# Altium schematic sheet Sheet1.SchDoc
size A2
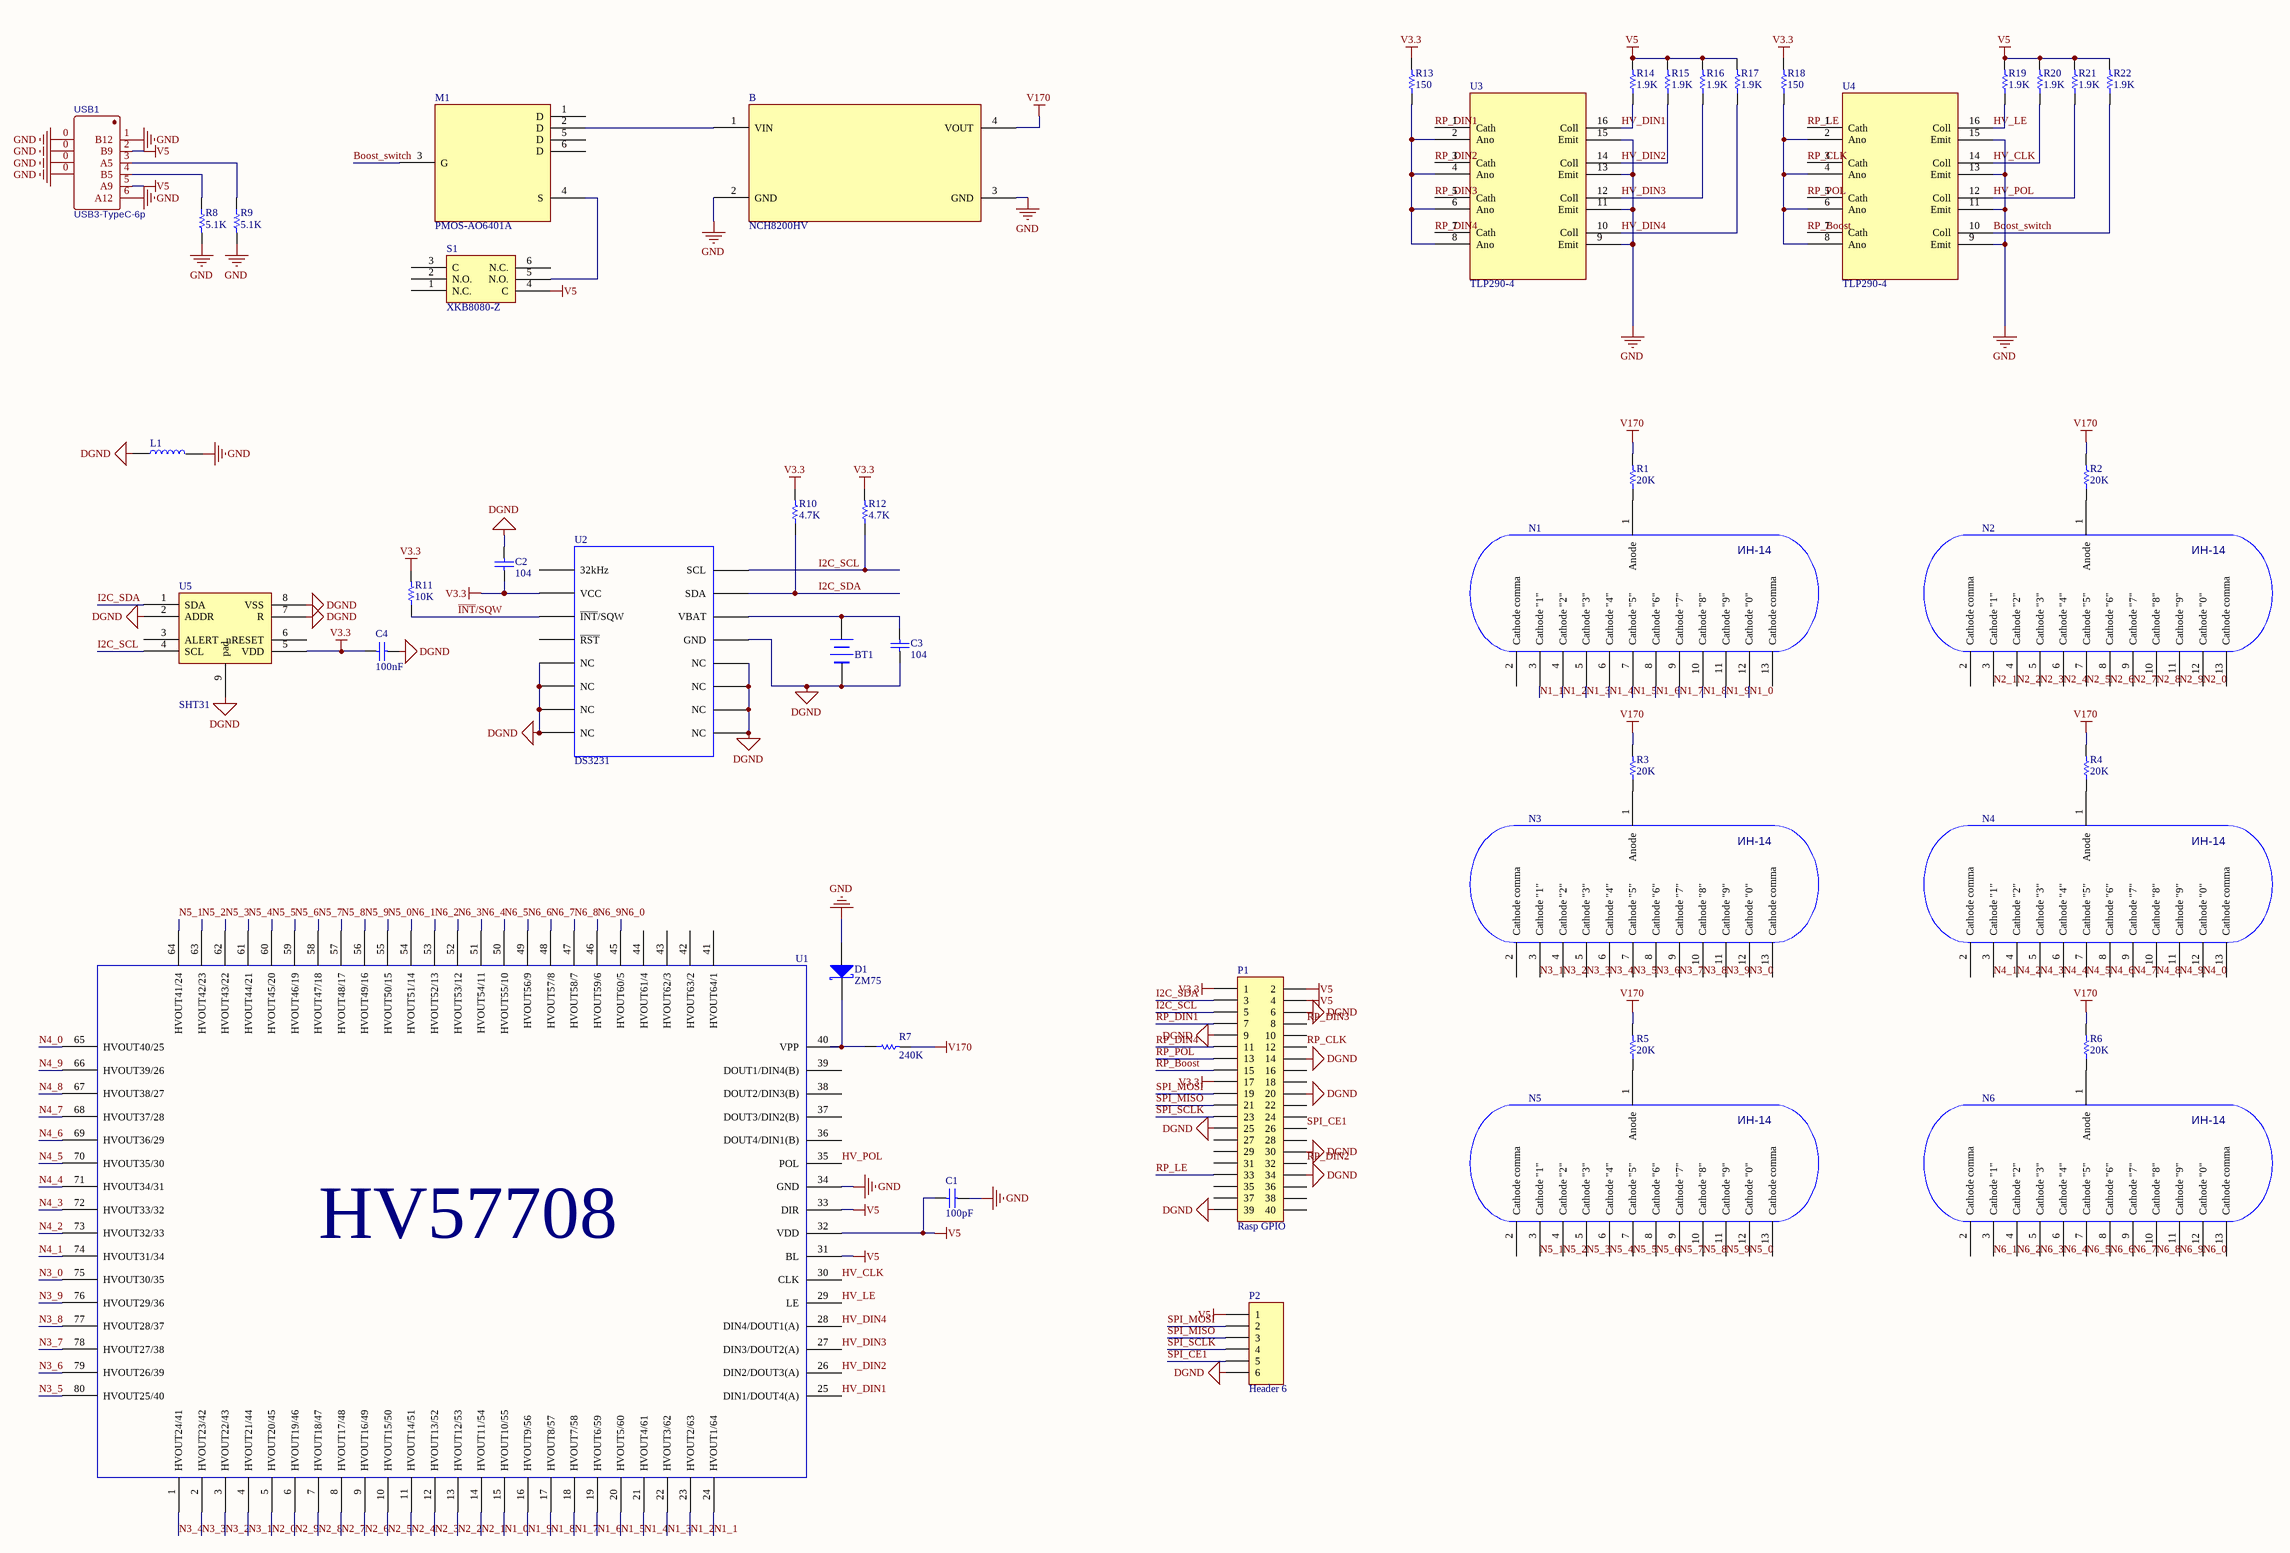
[diagram p0: Sheet1.SchDoc]

## Parts
B  NCH8200HV  [NCH8200HV]
BT1  CR1220 holder  [BAT1220]  (value not drawn)
C1  value 100pF  [C0603]  (hidden comment: Cap)
C2  value 104  [C0603]  (hidden comment: Cap Semi)
C3  value 104  [C0603]  (hidden comment: Cap Semi)
C4  value 100nF  [C0603]  (hidden comment: Cap)
D1  ZM75  [LL-34]
L1  L0  [0805]  (value not drawn)
M1  PMOS-AO6401A  [SOT95P250X110-6N]
N1  ИН-14  [IN14]  (value not drawn)
N2  ИН-14  [IN14]  (value not drawn)
N3  ИН-14  [IN14]  (value not drawn)
N4  ИН-14  [IN14]  (value not drawn)
N5  ИН-14  [IN14]  (value not drawn)
N6  ИН-14  [IN14]  (value not drawn)
P1  Rasp GPIO  [HDR2.54-LI-2x20P]
P2  Header 6  [HDR2.54-LI-6P]
R1  value 20K  [R0603]  (hidden comment: Res Semi)
R2  value 20K  [R0603]  (hidden comment: Res Semi)
R3  value 20K  [R0603]  (hidden comment: Res Semi)
R4  value 20K  [R0603]  (hidden comment: Res Semi)
R5  value 20K  [R0603]  (hidden comment: Res Semi)
R6  value 20K  [R0603]  (hidden comment: Res Semi)
R7  value 240K  [R0603]  (hidden comment: Res Semi)
R8  value 5.1K  [R0603]  (hidden comment: Res Semi)
R9  value 5.1K  [R0603]  (hidden comment: Res Semi)
R10  value 4.7K  [R0603]  (hidden comment: Res Semi)
R11  value 10K  [R0603]  (hidden comment: Res Semi)
R12  value 4.7K  [R0603]  (hidden comment: Res Semi)
R13  value 150  [R0603]  (hidden comment: Res Semi)
R14  value 1.9K  [R0603]  (hidden comment: Res Semi)
R15  value 1.9K  [R0603]  (hidden comment: Res Semi)
R16  value 1.9K  [R0603]  (hidden comment: Res Semi)
R17  value 1.9K  [R0603]  (hidden comment: Res Semi)
R18  value 150  [R0603]  (hidden comment: Res Semi)
R19  value 1.9K  [R0603]  (hidden comment: Res Semi)
R20  value 1.9K  [R0603]  (hidden comment: Res Semi)
R21  value 1.9K  [R0603]  (hidden comment: Res Semi)
R22  value 1.9K  [R0603]  (hidden comment: Res Semi)
S1  XKB8080-Z  [SW_PVA2EEH21.7NV2]
U1  HV57708  [HV57708PG]  (value not drawn)
U2  DS3231  [SOP16_75MM]
U3  TLP290-4  [SO16]
U4  TLP290-4  [SO16]
U5  SHT31  [SHT3x-x-P]
USB1  USB3-TypeC-6p  [USB-TYPE-C-SMD6]

## Nets
DGND: BT1.2(-) C2.2 C3.1 C4.1 L1.1 P1.6 P1.9 P1.14 P1.20 P1.25 P1.30 P1.34 P1.39 P2.6 U2.5(NC) U2.6(NC) U2.7(NC) U2.8(NC) U2.9(NC) U2.10(NC) U2.11(NC) U2.12(NC) U2.13(GND) U5.2(ADDR) U5.7(R) U5.8(VSS) U5.9(pad)
GND: B.2(GND) B.3(GND) C1.1 D1.1(A) L1.2 R8.2 R9.2 U1.34(GND) U3.9(Emit) U3.11(Emit) U3.13(Emit) U3.15(Emit) U4.9(Emit) U4.11(Emit) U4.13(Emit) U4.15(Emit) USB1.0 USB1.1(B12) USB1.6(A12)
V3.3: C2.1 C4.2 P1.1 P1.17 R10.2 R11.2 R12.2 R13.2 R18.2 U2.2(VCC) U5.5(VDD)
V5: C1.2 P1.2 P1.4 P2.1 R14.2 R15.2 R16.2 R17.2 R19.2 R20.2 R21.2 R22.2 S1.4(C) U1.31(BL) U1.32(VDD) U1.33(DIR) USB1.2(B9) USB1.5(A9)
V170: B.4(VOUT) R1.2 R2.2 R3.2 R4.2 R5.2 R6.2 R7.2
~{INT}/SQW: R11.1 U2.3(~{INT}/SQW)
Boost_switch: M1.3(G) R22.1 U4.10(Coll)
HV_CLK: R20.1 U1.30(CLK) U4.14(Coll)
HV_DIN1: R14.1 U1.25(DIN1/DOUT4(A)) U3.16(Coll)
HV_DIN2: R15.1 U1.26(DIN2/DOUT3(A)) U3.14(Coll)
HV_DIN3: R16.1 U1.27(DIN3/DOUT2(A)) U3.12(Coll)
HV_DIN4: R17.1 U1.28(DIN4/DOUT1(A)) U3.10(Coll)
HV_LE: R19.1 U1.29(LE) U4.16(Coll)
HV_POL: R21.1 U1.35(POL) U4.12(Coll)
I2C_SCL: P1.5 R12.1 U2.16(SCL) U5.4(SCL)
I2C_SDA: P1.3 R10.1 U2.15(SDA) U5.1(SDA)
N1_0: N1.12(Cathode_"0") U1.15(HVOUT10/55)
N1_1: N1.3(Cathode_"1") U1.24(HVOUT1/64)
N1_2: N1.4(Cathode_"2") U1.23(HVOUT2/63)
N1_3: N1.5(Cathode_"3") U1.22(HVOUT3/62)
N1_4: N1.6(Cathode_"4") U1.21(HVOUT4/61)
N1_5: N1.7(Cathode_"5") U1.20(HVOUT5/60)
N1_6: N1.8(Cathode_"6") U1.19(HVOUT6/59)
N1_7: N1.9(Cathode_"7") U1.18(HVOUT7/58)
N1_8: N1.10(Cathode_"8") U1.17(HVOUT8/57)
N1_9: N1.11(Cathode_"9") U1.16(HVOUT9/56)
N2_0: N2.12(Cathode_"0") U1.5(HVOUT20/45)
N2_1: N2.3(Cathode_"1") U1.14(HVOUT11/54)
N2_2: N2.4(Cathode_"2") U1.13(HVOUT12/53)
N2_3: N2.5(Cathode_"3") U1.12(HVOUT13/52)
N2_4: N2.6(Cathode_"4") U1.11(HVOUT14/51)
N2_5: N2.7(Cathode_"5") U1.10(HVOUT15/50)
N2_6: N2.8(Cathode_"6") U1.9(HVOUT16/49)
N2_7: N2.9(Cathode_"7") U1.8(HVOUT17/48)
N2_8: N2.10(Cathode_"8") U1.7(HVOUT18/47)
N2_9: N2.11(Cathode_"9") U1.6(HVOUT19/46)
N3_0: N3.12(Cathode_"0") U1.75(HVOUT30/35)
N3_1: N3.3(Cathode_"1") U1.4(HVOUT21/44)
N3_2: N3.4(Cathode_"2") U1.3(HVOUT22/43)
N3_3: N3.5(Cathode_"3") U1.2(HVOUT23/42)
N3_4: N3.6(Cathode_"4") U1.1(HVOUT24/41)
N3_5: N3.7(Cathode_"5") U1.80(HVOUT25/40)
N3_6: N3.8(Cathode_"6") U1.79(HVOUT26/39)
N3_7: N3.9(Cathode_"7") U1.78(HVOUT27/38)
N3_8: N3.10(Cathode_"8") U1.77(HVOUT28/37)
N3_9: N3.11(Cathode_"9") U1.76(HVOUT29/36)
N4_0: N4.12(Cathode_"0") U1.65(HVOUT40/25)
N4_1: N4.3(Cathode_"1") U1.74(HVOUT31/34)
N4_2: N4.4(Cathode_"2") U1.73(HVOUT32/33)
N4_3: N4.5(Cathode_"3") U1.72(HVOUT33/32)
N4_4: N4.6(Cathode_"4") U1.71(HVOUT34/31)
N4_5: N4.7(Cathode_"5") U1.70(HVOUT35/30)
N4_6: N4.8(Cathode_"6") U1.69(HVOUT36/29)
N4_7: N4.9(Cathode_"7") U1.68(HVOUT37/28)
N4_8: N4.10(Cathode_"8") U1.67(HVOUT38/27)
N4_9: N4.11(Cathode_"9") U1.66(HVOUT39/26)
N5_0: N5.12(Cathode_"0") U1.55(HVOUT50/15)
N5_1: N5.3(Cathode_"1") U1.64(HVOUT41/24)
N5_2: N5.4(Cathode_"2") U1.63(HVOUT42/23)
N5_3: N5.5(Cathode_"3") U1.62(HVOUT43/22)
N5_4: N5.6(Cathode_"4") U1.61(HVOUT44/21)
N5_5: N5.7(Cathode_"5") U1.60(HVOUT45/20)
N5_6: N5.8(Cathode_"6") U1.59(HVOUT46/19)
N5_7: N5.9(Cathode_"7") U1.58(HVOUT47/18)
N5_8: N5.10(Cathode_"8") U1.57(HVOUT48/17)
N5_9: N5.11(Cathode_"9") U1.56(HVOUT49/16)
N6_0: N6.12(Cathode_"0") U1.45(HVOUT60/5)
N6_1: N6.3(Cathode_"1") U1.54(HVOUT51/14)
N6_2: N6.4(Cathode_"2") U1.53(HVOUT52/13)
N6_3: N6.5(Cathode_"3") U1.52(HVOUT53/12)
N6_4: N6.6(Cathode_"4") U1.51(HVOUT54/11)
N6_5: N6.7(Cathode_"5") U1.50(HVOUT55/10)
N6_6: N6.8(Cathode_"6") U1.49(HVOUT56/9)
N6_7: N6.9(Cathode_"7") U1.48(HVOUT57/8)
N6_8: N6.10(Cathode_"8") U1.47(HVOUT58/7)
N6_9: N6.11(Cathode_"9") U1.46(HVOUT59/6)
RP_Boost: P1.15 U4.7(Cath)
RP_CLK: P1.12 U4.3(Cath)
RP_DIN1: P1.7 U3.1(Cath)
RP_DIN2: P1.32 U3.3(Cath)
RP_DIN3: P1.8 U3.5(Cath)
RP_DIN4: P1.11 U3.7(Cath)
RP_LE: P1.33 U4.1(Cath)
RP_POL: P1.13 U4.5(Cath)
SPI_CE1: P1.26 P2.5
SPI_MISO: P1.21 P2.3
SPI_MOSI: P1.19 P2.2
SPI_SCLK: P1.23 P2.4
NetB_1: B.1(VIN) M1.2(D)
NetBT1_1: BT1.1(+) C3.2 U2.14(VBAT)
NetD1_2: D1.2(K) R7.1 U1.40(VPP)
NetM1_4: M1.4(S) S1.5(N.O.)
NetN1_1: N1.1(Anode) R1.1
NetN2_1: N2.1(Anode) R2.1
NetN3_1: N3.1(Anode) R3.1
NetN4_1: N4.1(Anode) R4.1
NetN5_1: N5.1(Anode) R5.1
NetN6_1: N6.1(Anode) R6.1
NetR8_1: R8.1 USB1.4(B5)
NetR9_1: R9.1 USB1.3(A5)
NetR13_1: R13.1 U3.2(Ano) U3.4(Ano) U3.6(Ano) U3.8(Ano)
NetR18_1: R18.1 U4.2(Ano) U4.4(Ano) U4.6(Ano) U4.8(Ano)

Not connected (* = marked no-connect by the designer): M1 1(D) 5(D) 6(D); N1 2(Cathode_comma) 13(Cathode_comma); N2 2(Cathode_comma) 13(Cathode_comma); N3 2(Cathode_comma) 13(Cathode_comma); N4 2(Cathode_comma) 13(Cathode_comma); N5 2(Cathode_comma) 13(Cathode_comma); N6 2(Cathode_comma) 13(Cathode_comma); P1 10 16 18 22 24 27 28 29 31 35 36 37 38 40; S1 1(N.C.) 2(N.O.) 3(C) 6(N.C.); U1 36(DOUT4/DIN1(B)) 37(DOUT3/DIN2(B)) 38(DOUT2/DIN3(B)) 39(DOUT1/DIN4(B)) 41(HVOUT64/1) 42(HVOUT63/2) 43(HVOUT62/3) 44(HVOUT61/4); U2 1(32kHz) 4(~{RST}); U5 3(ALERT) 6(nRESET)

## Library data of the parts
BT1 = BATTERY
C1 C4 = Cap: Capacitor; Published: 8-Jun-2000; LatestRevisionDate: 17-Jul-2002; LatestRevisionNote: Re-released for DXP Platform.; PackageReference: RAD-0.3; Publisher: Altium Limited; PackageDescription: Radial Cap, Thru-Hole; 2 Leads; 0.3 in Pin Spacing
C2 C3 = Cap Semi: Capacitor (Semiconductor SIM Model); Published: 8-Jun-2000; LatestRevisionDate: 17-Jul-2002; LatestRevisionNote: Re-released for DXP Platform.; PackageReference: C1206; Publisher: Altium Limited
D1 = Diode 11DQ03: Schottky Rectifier; Published: 8-Jun-2000; LatestRevisionDate: 17-Jul-2002; LatestRevisionNote: Re-released for DXP Platform.; DatasheetVersion: Dec-1997; PackageReference: DO-204AL; Publisher: Altium Limited; PackageDescription: Diode, Axial; Body 5.2 x 2.7 mm (LxDia. max), Lead Dia. 0.86 mm (max); Code_JEDEC: DO-204-AL; ComponentLink1Description: Manufacturer Link; ComponentLink1URL: http://www.irf.com/; ComponentLink2Description: Datasheet; ComponentLink2URL: http://www.irf.com/product-info/datasheets/data/11dq03.pdf
M1 = AO6401A
P1 = Header 20X2: Header, 20-Pin, Dual row; LatestRevisionDate: 17-Jul-2002; LatestRevisionNote: Re-released for DXP Platform.; Publisher: Altium Limited
P2 = Header 6: Header, 6-Pin; LatestRevisionDate: 17-Jul-2002; LatestRevisionNote: Re-released for DXP Platform.; Publisher: Altium Limited
R1-R22 = Res Semi: Semiconductor Resistor; Published: 8-Jun-2000; LatestRevisionDate: 17-Jul-2002; LatestRevisionNote: Re-released for DXP Platform.; PackageReference: AXIAL-0.5; Publisher: Altium Limited